# Altium schematic sheet Ethernet.SchDoc: Ethernet PHY with RJ45 connector
size A3; Date: Not used; ApprovedBy: Not used; CheckedBy: Not used; Author: Not used; CompanyName: STMicroelectronics; DrawnBy: Not used; Engineer: Not used; Organization: Not used; Address1: Not used; Address2: Not used; Address3: Not used; Address4: Not used; DocumentNumber: 6; Revision: Not used; SheetNumber: 4; SheetTotal: 10; Time: Not used; ImagePath: Not used; Application_BuildNumber: Not used
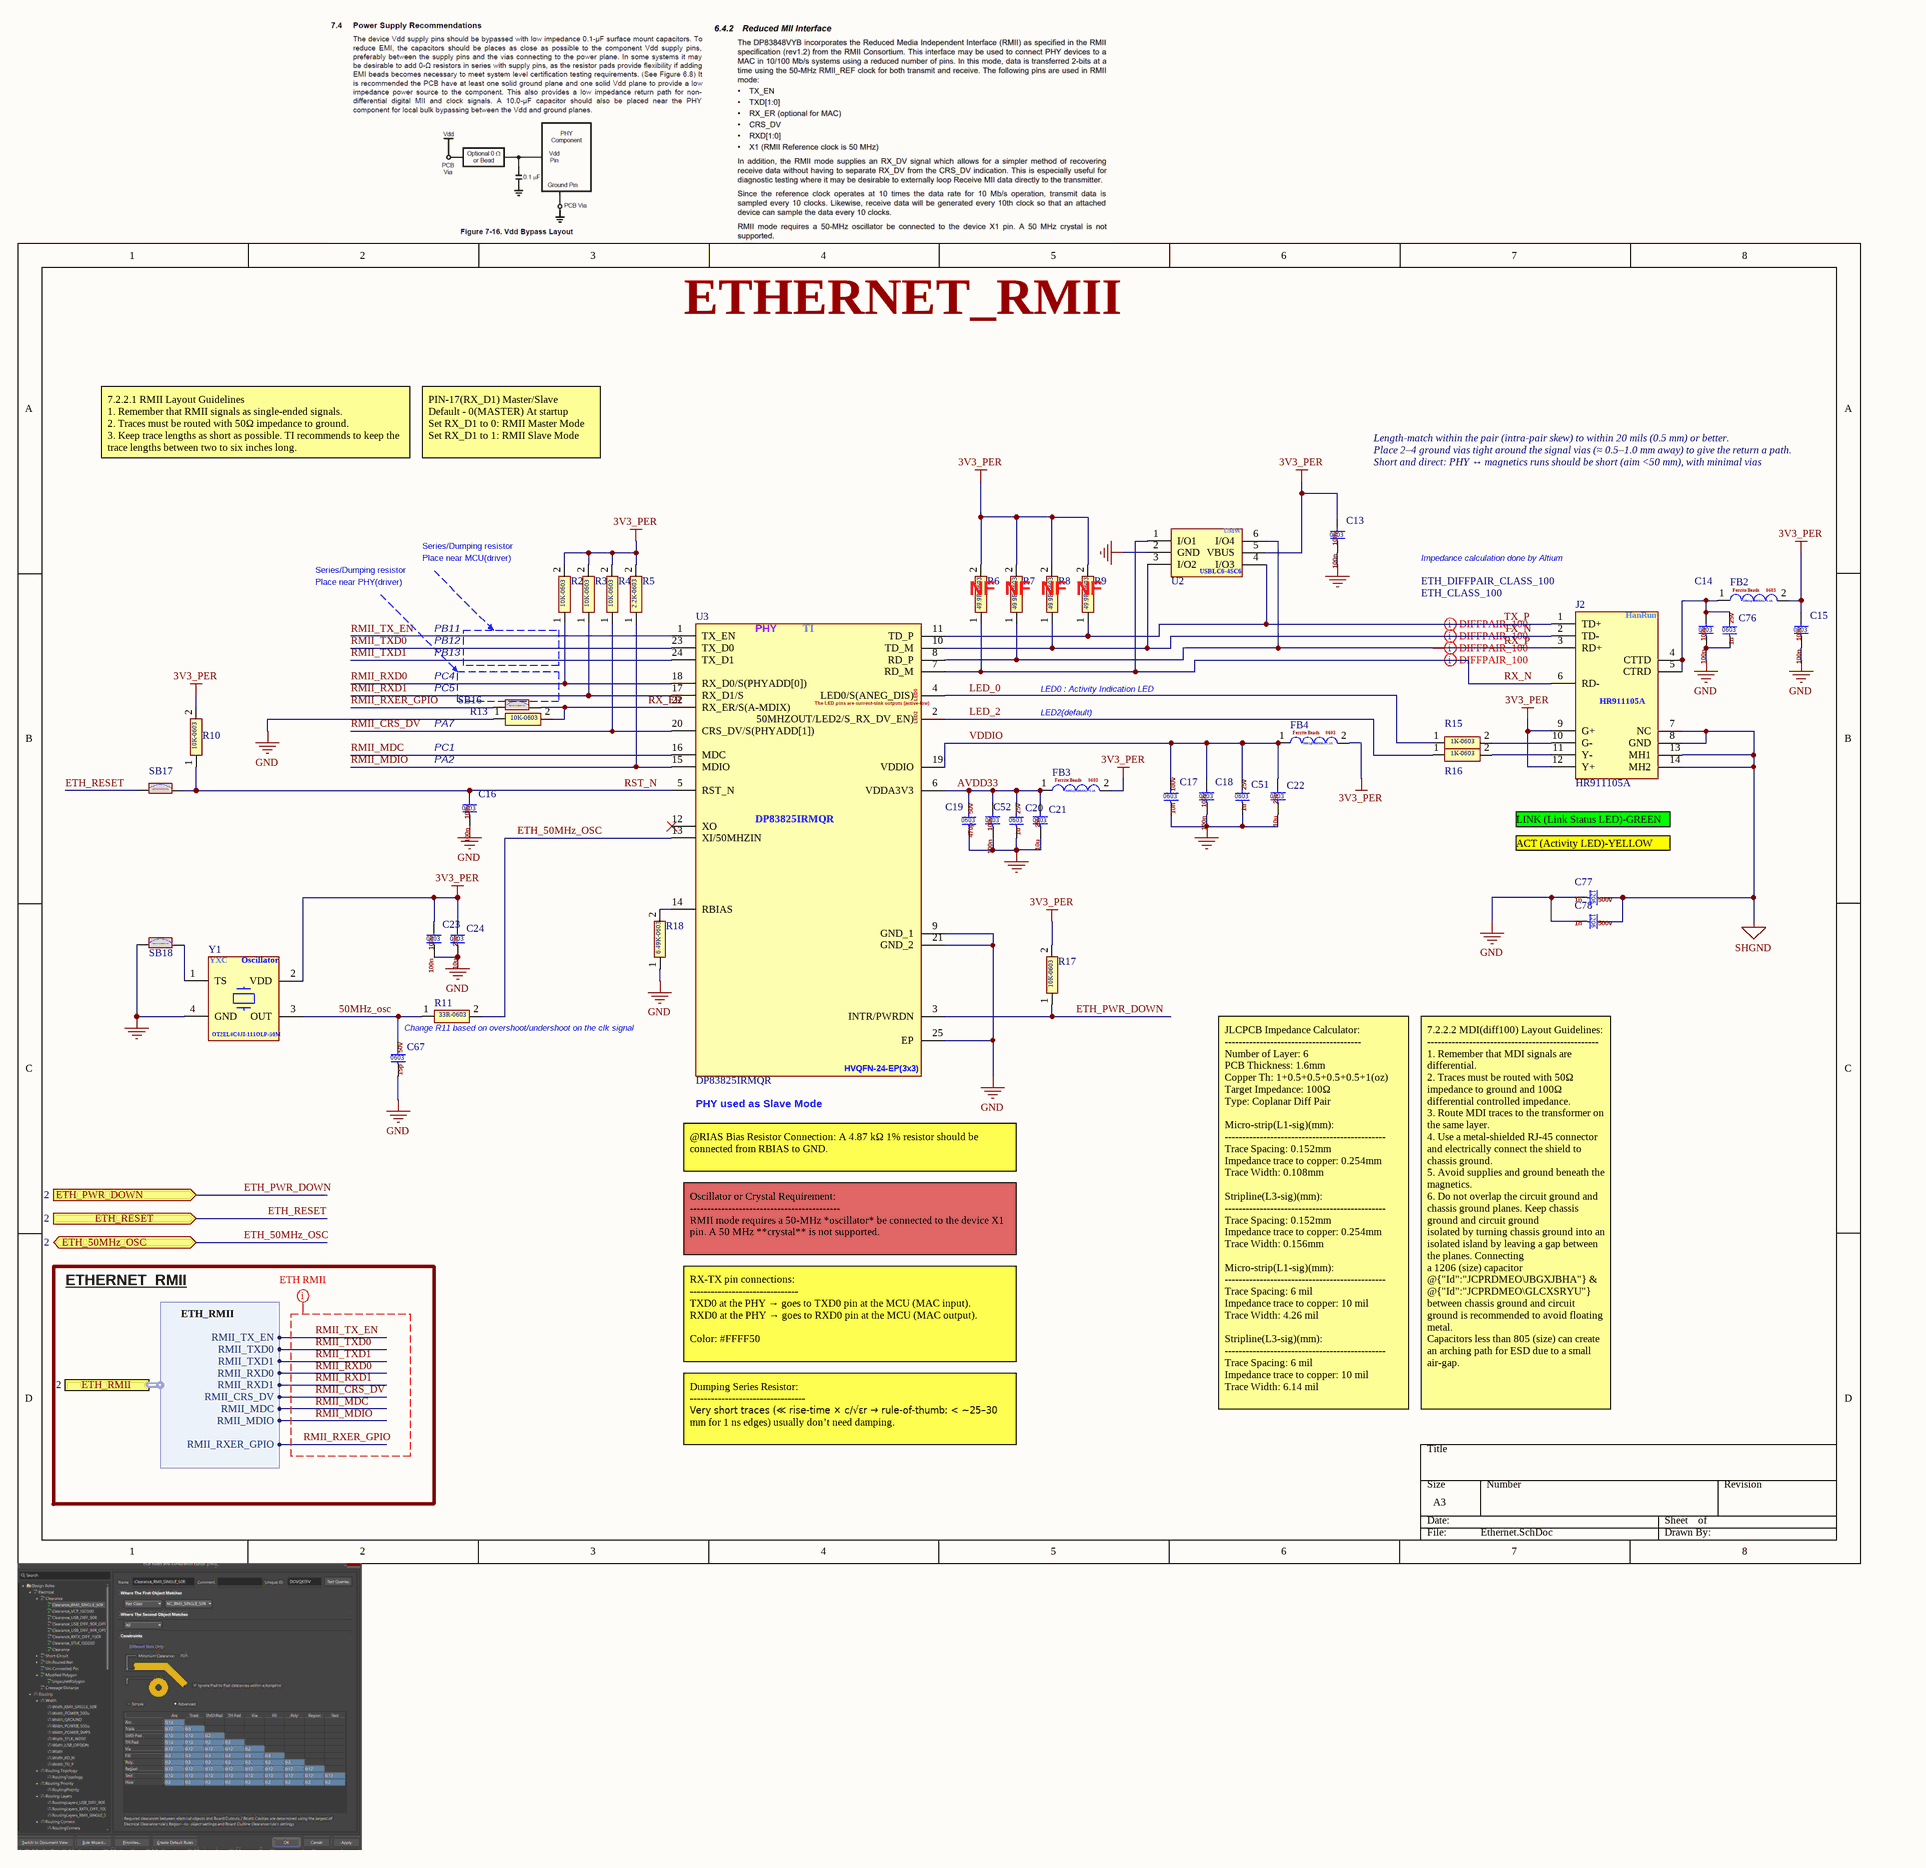
[diagram p0: Ethernet.SchDoc]

## Parts
C13  CL10B104KC8NNNC  [0603-CAP]  (value not drawn)
C14  CL10B104KC8NNNC  [0603-CAP]  (value not drawn)
C15  CL10B104KC8NNNC  [0603-CAP]  (value not drawn)
C16  CL10B104KC8NNNC  [0603-CAP]  (value not drawn)
C17  CL10B103KC8WPNC  [0603-CAP]  (value not drawn)
C18  CL10B104KC8NNNC  [0603-CAP]  (value not drawn)
C19  CL10B471KB8NNNC  [0603-CAP]  (value not drawn)
C20  CL10B105KA8NNNC  [0603-CAP]  (value not drawn)
C21  CL10A106MA8NRNC  [0603-CAP]  (value not drawn)
C22  CL10A106MA8NRNC  [0603-CAP]  (value not drawn)
C23  CL10B104KC8NNNC  [0603-CAP]  (value not drawn)
C24  CL10A106MA8NRNC  [0603-CAP]  (value not drawn)
C51  CL10B105KA8NNNC  [0603-CAP]  (value not drawn)
C52  CL10B104KC8NNNC  [0603-CAP]  (value not drawn)
C67  CL10C150JB8NNNC  [0603-CAP]  (value not drawn)
C76  CL10B105KA8NNNC  [0603-CAP]  (value not drawn)
C77  CL31B102KGFNNNE  [1206-CAP]  (value not drawn)
C78  CL31B102KGFNNNE  [1206-CAP]  (value not drawn)
FB2  BLM18KG601SN1D  [Ferrite Beads 0603]  (value not drawn)
FB3  BLM18KG601SN1D  [Ferrite Beads 0603]  (value not drawn)
FB4  BLM18KG601SN1D  [Ferrite Beads 0603]  (value not drawn)
J2  HR911105A  [HR911105A]
R2  0603WAF1002T5E  [0603-RES]  (value not drawn)
R3  0603WAF1002T5E  [0603-RES]  (value not drawn)
R4  0603WAF1002T5E  [0603-RES]  (value not drawn)
R5  0603WAF2201T5E  [0603-RES]  (value not drawn)
R6  0603WAF499JT5E  [0603-RES]  (value not drawn)
R7  0603WAF499JT5E  [0603-RES]  (value not drawn)
R8  0603WAF499JT5E  [0603-RES]  (value not drawn)
R9  0603WAF499JT5E  [0603-RES]  (value not drawn)
R10  0603WAF1002T5E  [0603-RES]  (value not drawn)
R11  0603WAF330JT5E  [0603-RES]  (value not drawn)
R13  0603WAF1002T5E  [0603-RES]  (value not drawn)
R15  0603WAF1001T5E  [0603-RES]  (value not drawn)
R16  0603WAF1001T5E  [0603-RES]  (value not drawn)
R17  0603WAF1002T5E  [0603-RES]  (value not drawn)
R18  0603WAF6491T5E  [0603-RES]  (value not drawn)
SB16  0603WAF0000T5E  [SOLDER-BRIDGE_R0603-0R]  (value not drawn)
SB17  0603WAF0000T5E  [SOLDER-BRIDGE_R0603-0R]  (value not drawn)
SB18  0603WAF0000T5E  [SOLDER-BRIDGE_R0603-0R]  (value not drawn)
U2  USBLC6-4SC6  [SOT-23-6]  (value not drawn)
U3  DP83825IRMQR  [HVQFN-24-EP(3x3)]
Y1  OT2EL4C4JI-111OLP-50M  [SMD3225-4P]  (value not drawn)

## Ports
ETH_50MHz_OSC (bidir, see 2), ETH_PWR_DOWN (in, see 2), ETH_RESET (in, see 2), ETH_RMII (harness ETH_RMII, see 2)

## Harnesses
ETH_RMII: RMII_TX_EN, RMII_TXD0, RMII_TXD1, RMII_RXD0, RMII_RXD1, RMII_CRS_DV, RMII_RXER_GPIO, RMII_MDC, RMII_MDIO

## Nets
3V3_PER: C13.2 C15.2 C23.2 C24.2 FB2.2 FB3.2 FB4.2 J2.9(G+) J2.12(Y+) R2.2 R3.2 R4.2 R5.2 R6.2 R7.2 R8.2 R9.2 R10.2 R17.2 U2.5(VBUS) Y1.2(VDD)
GND: C13.1 C14.1 C15.1 C16.1 C17.1 C18.1 C19.1 C20.1 C21.1 C22.1 C23.1 C24.1 C51.1 C52.1 C67.1 C76.1 C77.1 C78.1 R13.1 R18.1 SB18.1 U2.2(GND) U3.9(GND_1) U3.21(GND_2) U3.25(EP) Y1.4(GND)
SHGND: C77.2 C78.2 J2.7(NC) J2.8(GND) J2.13(MH1) J2.14(MH2)
50MHz_osc: C67.2 R11.1 Y1.3(OUT)
AVDD33: C19.2 C20.2 C21.2 C52.2 FB3.1 U3.6(VDDA3V3)
ETH_50MHz_OSC: R11.2 U3.13(XI/50MHZIN) ; port ETH_50MHz_OSC
ETH_PWR_DOWN: R17.1 U3.3(INTR/PWRDN) ; port ETH_PWR_DOWN
ETH_RESET: SB17.1 ; port ETH_RESET
LED_0: R15.1 U3.4(LED0/S(ANEG_DIS))
LED_2: R16.1 U3.2(50MHZOUT/LED2/S_RX_DV_EN))
RMII_CRS_DV: R4.1 U3.20(CRS_DV/S(PHYADD[1])) ; port ETH_RMII.RMII_CRS_DV
RMII_MDC: U3.16(MDC) ; port ETH_RMII.RMII_MDC
RMII_MDIO: R5.1 U3.15(MDIO) ; port ETH_RMII.RMII_MDIO
RMII_RXD0: R2.1 U3.18(RX_D0/S(PHYADD[0])) ; port ETH_RMII.RMII_RXD0
RMII_RXD1: R3.1 U3.17(RX_D1/S) ; port ETH_RMII.RMII_RXD1
RMII_RXER_GPIO: SB16.1 ; port ETH_RMII.RMII_RXER_GPIO
RMII_TX_EN: U3.1(TX_EN) ; port ETH_RMII.RMII_TX_EN
RMII_TXD0: U3.23(TX_D0) ; port ETH_RMII.RMII_TXD0
RMII_TXD1: U3.24(TX_D1) ; port ETH_RMII.RMII_TXD1
RST_N: C16.2 R10.1 SB17.2 U3.5(RST_N)
RX_ER: R13.2 SB16.2 U3.22(RX_ER/S(A-MDIX))
RX_N: J2.6(RD-) R6.1 U2.1(I/O1) U3.7(RD_M)
RX_P: J2.3(RD+) R7.1 U2.6(I/O4) U3.8(RD_P)
TX_N: J2.2(TD-) R8.1 U2.3(I/O2) U3.10(TD_M)
TX_P: J2.1(TD+) R9.1 U2.4(I/O3) U3.11(TD_P)
VDDIO: C17.2 C18.2 C22.2 C51.2 FB4.1 U3.19(VDDIO)
NetC14_2: C14.2 C76.2 FB2.1 J2.4(CTTD) J2.5(CTRD)
NetJ2_10: J2.10(G-) R15.2
NetJ2_11: J2.11(Y-) R16.2
NetR18_2: R18.2 U3.14(RBIAS)
NetSB18_2: SB18.2 Y1.1(TS)

Not connected (* = marked no-connect by the designer): U3 12(XO)*

## Layout directives
differential pair; differential pair class ETH_DIFFPAIR_CLASS_100; net class ETH_CLASS_100: RX_N, RX_P, TX_N, TX_P
net class ETH_RMII_CLASS_50; rule Matched Net Lengths [Tolerance = 20mil]: RMII_CRS_DV, RMII_MDC, RMII_MDIO, RMII_RXD0, RMII_RXD1, RMII_RXER_GPIO, RMII_TX_EN, RMII_TXD0, RMII_TXD1

## Notes on the sheet
- ETHERNET_RMII
- 7.2.2.1 RMII Layout Guidelines
  1. Remember that RMII signals as single-ended signals.
  2. Traces must be routed with 50Ω impedance to ground.
  3. Keep trace lengths as short as possible. TI recommends to keep the trace lengths between two to six inches long.
- PIN-17(RX_D1) Master/Slave
  Default - 0(MASTER) At startup
  Set RX_D1 to 0: RMII Master Mode
  Set RX_D1 to 1: RMII Slave Mode
- Length-match within the pair (intra-pair skew) to within 20 mils (0.5 mm) or better.
- Place 2–4 ground vias tight around the signal vias (≈ 0.5–1.0 mm away) to give the return a path.
- Short and direct: PHY ↔ magnetics runs should be short (aim <50 mm), with minimal vias
- Series/Dumping resistor
- Place near MCU(driver)
- Impedance calculation done by Altium
- Place near PHY(driver)
- PB11
- (near R6) NF
- (near R7) NF
- (near R8) NF
- (near R9) NF
- PB12
- PB13
- PC4
- PC5
- LED0 : Activity Indication LED
- PA7
- PC1
- (near U3) Pull-down: Disable Auto-MDIX
- LED2(default)
- (near C16) PA2
- LINK (Link Status LED)-GREEN
- ACT (Activity LED)-YELLOW
- (near R11) Change R11 based on overshoot/undershoot on the clk signal
- PHY used as Slave Mode
- @RIAS Bias Resistor Connection: A 4.87 kΩ 1% resistor should be connected from RBIAS to GND.
- Oscillator or Crystal Requirement:
  -------------------------------------------
  RMII mode requires a 50-MHz *oscillator* be connected to the device X1 pin. A 50 MHz **crystal** is not supported.
- RX-TX pin connections:
  -------------------------------
  TXD0 at the PHY → goes to TXD0 pin at the MCU (MAC input).
  RXD0 at the PHY → goes to RXD0 pin at the MCU (MAC output).
  Color: #FFFF50
- JLCPCB Impedance Calculator:
  ---------------------------------------
  Number of Layer: 6
  PCB Thickness: 1.6mm
  Copper Th: 1+0.5+0.5+0.5+0.5+1(oz)
  Target Impedance: 100Ω
  Type: Coplanar Diff Pair
  Micro-strip(L1-sig)(mm):
  ----------------------------------------------
  Trace Spacing: 0.152mm
  Impedance trace to copper: 0.254mm
  Trace Width: 0.108mm
  Stripline(L3-sig)(mm):
  ----------------------------------------------
  Trace Spacing: 0.152mm
  Impedance trace to copper: 0.254mm
  Trace Width: 0.156mm
  Micro-strip(L1-sig)(mm):
  ----------------------------------------------
  Trace Spacing: 6 mil
  Impedance trace to copper: 10 mil
  Trace Width: 4.26 mil
  Stripline(L3-sig)(mm):
  ----------------------------------------------
  Trace Spacing: 6 mil
  Impedance trace to copper: 10 mil
  Trace Width: 6.14 mil
- 7.2.2.2 MDI(diff100) Layout Guidelines:
  -------------------------------------------------
  1. Remember that MDI signals are differential.
  2. Traces must be routed with 50Ω impedance to ground and 100Ω differential controlled impedance.
  3. Route MDI traces to the transformer on the same layer.
  4. Use a metal-shielded RJ-45 connector and electrically connect the shield to chassis ground.
  5. Avoid supplies and ground beneath the magnetics.
  6. Do not overlap the circuit ground and chassis ground planes. Keep chassis ground and circuit ground
  isolated by turning chassis ground into an isolated island by leaving a gap between the planes. Connecting
  a 1206 (size) capacitor @{"Id":"JCPRDMEO\JBGXJBHA"} & @{"Id":"JCPRDMEO\GLCXSRYU"} between chassis ground and circuit ground is recommended to avoid floating metal.
  Capacitors less than 805 (size) can create an arching path for ESD due to a small air-gap.
- Dumping Series Resistor:
  ---------------------------------
  Very short traces (≪ rise-time × c/√εr → rule-of-thumb: < ~25–30 mm for 1 ns edges) usually don’t need damping.
- Title:
- Project:
- Size:
- Revision:
- Variant:
- A4
- -
- Date:
- Reference:
- Sheet:
- of
- (in symbol 0603WAF330JT5E) 33R-0603
- (in symbol 0603WAF499JT5E) 49.9R-0603
- (in symbol 0603WAF1001T5E) 1K-0603
- (in symbol 0603WAF1002T5E) 10K-0603
- (in symbol 0603WAF2201T5E) 2.2K-0603
- (in symbol 0603WAF6491T5E) 6.49K-0603
- (in symbol BLM18KG601SN1D) Ferrite Beads; 0603; 600Ω@100MHz, 1.3A
- (in symbol CL10A106MA8NRNC) 25v; 0603; 10u
- (in symbol CL10B103KC8WPNC) 100v; 0603; 10n
- (in symbol CL10B104KC8NNNC) 100v; 0603; 100n
- (in symbol CL10B105KA8NNNC) 25v; 0603; 1u
- (in symbol CL10B471KB8NNNC) 50v; 0603; 470p
- (in symbol CL10C150JB8NNNC) 50v; 0603; 15p
- (in symbol CL31B102KGFNNNE) 1206; 1n; 500v
- (in symbol DP83825IRMQR) PHY; TI; LED0; The LED pins are current-sink outputs (active-low); LED2; HVQFN-24-EP(3x3)
- (in symbol HR911105A) HanRun
- (in symbol OT2EL4C4JI-111OLP-50M) YXC; Oscillator
- (in symbol USBLC6-4SC6) UMW

## Library data of the parts
C13-C16 C18 C23 C52 = CL10B104KC8NNNC: CAP: CER 100NF 100V X7R 0603; POC Price: 0.006; LCSC Part #: C15725; Unit Price: 0.0036; ComponentLink1Description: DS; ComponentLink1URL: https://www.lcsc.com/datasheet/C15725.pdf
C17 = CL10B103KC8WPNC: CAP: CER 10NF 100V X7R 0603; LCSC Part #: C307347; Unit Price: 0.0046
C19 = CL10B471KB8NNNC: CAP: CER 470PF 50V X7R 0603; POC Price: 0.0047; LCSC Part #: C22396; Unit Price: 0.002; ComponentLink1Description: DS; ComponentLink1URL: https://www.lcsc.com/datasheet/C22396.pdf
C20 C51 C76 = CL10B105KA8NNNC: CAP: CER 1UF 25V X7R 0603; LCSC Part #: C29936; Unit Price: 0.0027; ComponentLink1Description: DS; ComponentLink1URL: https://www.lcsc.com/datasheet/C29936.pdf
C21 C22 C24 = CL10A106MA8NRNC: CAP: CER 10UF 25V X5R 0603; LCSC Part #: C96446; Unit Price: 0.01; ComponentLink1Description: DS; ComponentLink1URL: https://www.lcsc.com/datasheet/C96446.pdf
C67 = CL10C150JB8NNNC: CAP: CER 15PF 50V C0G 0603; POC Price: 0.0051; LCSC Part #: C1644; Unit Price: 0.0032; ComponentLink1Description: DS; ComponentLink1URL: https://www.lcsc.com/datasheet/C1644.pdf
C77 C78 = CL31B102KGFNNNE: CAP: SAFETY CER 1NF 500V X7R 1206; POC Price: 0.04; LCSC Part #: C35216; Unit Price: 0.0223; ComponentLink1Description: DS; ComponentLink1URL: https://www.lcsc.com/datasheet/C35216.pdf
FB2-FB4 = BLM18KG601SN1D: Ferrite Beads: 150mΩ 600Ω@100MHz 1.3A muRata; POC Price: 0.0113; LCSC Part #: C85833; Unit Price: 0.0059; ComponentLink1Description: DS; ComponentLink1URL: https://www.lcsc.com/datasheet/C85833.pdf
J2 = HR911105A: RJ45: ETH RJ45 Jack 1 With LED Through Hole Ethernet Connectors / Modular Connectors (RJ45 RJ11) ROHS; POC Price: 1.4848; LCSC Part #: C12074; Unit Price: 0.8599; ComponentLink1Description: DS; ComponentLink1URL: https://datasheet.lcsc.com/szlcsc/Zhongshan-HanRun-Elec-HR911105A_C12074.pdf
R2-R4 R10 R13 R17 = 0603WAF1002T5E: RES: 10K OHM 1% 100mW 0603 75V; LCSC Part #: C25804; Unit Price: 0.0005; ComponentLink1Description: DS; ComponentLink1URL: https://www.lcsc.com/datasheet/C25804.pdf
R5 = 0603WAF2201T5E: RES: 2.2K OHM 1% 100mW 0603 75V; POC Price: 0.0011; LCSC Part #: C4190; Unit Price: 0.0005; ComponentLink1Description: DS; ComponentLink1URL: https://www.lcsc.com/datasheet/C4184.pdf
R6-R9 = 0603WAF499JT5E: RES: 49.9 OHM 1% 100mW 0603; LCSC Part #: C23185; Unit Price: 0.0006; ComponentLink1Description: DS; ComponentLink1URL: https://www.lcsc.com/datasheet/C23185.pdf
R11 = 0603WAF330JT5E: RES: 33 OHM 1% 100mW 0603 75V; POC Price: 0.0011; LCSC Part #: C23140; Unit Price: 0.0006; ComponentLink1Description: DS; ComponentLink1URL: https://www.lcsc.com/datasheet/C4216.pdf
R15 R16 = 0603WAF1001T5E: RES: 1K OHM 1% 100mW 0603 75V; LCSC Part #: C21190; Unit Price: 0.0005; ComponentLink1Description: DS; ComponentLink1URL: https://www.lcsc.com/datasheet/C21190.pdf
R18 = 0603WAF6491T5E: RES: 6.49K OHM 1% 100mW 0603 75V; POC Price: 0.0011; LCSC Part #: C23088; Unit Price: 0.0006; ComponentLink1Description: DS; ComponentLink1URL: https://www.lcsc.com/datasheet/C23088.pdf
SB16-SB18 = 0603WAF0000T5E: Solder Bridge: ON SB 0603; LCSC Part #: C21189; Unit Price: 0.0006; ComponentLink1Description: DS; ComponentLink1URL: https://www.lcsc.com/datasheet/C21189.pdf
U2 = USBLC6-4SC6: ESD: 3.5A@8/20us 13V 60W@8/20us 7.8V 5V SOT-23-6 ESD and Surge Protection (TVS/ESD) ROHS; POC Price: 0.0286; LCSC Part #: C19626383; Unit Price: 0.0133; ComponentLink1Description: DS; ComponentLink1URL: https://www.lcsc.com/datasheet/C19626383.pdf
U3 = DP83825IRMQR: PHY: Ethernet Transceiver RMII HVQFN-24-EP(3x3) Ethernet Transceivers ROHS; POC Price: 0.2675; LCSC Part #: C783599; ComponentLink1Description: DS; ComponentLink1URL: https://www.ti.com/lit/ds/symlink/dp83825i.pdf?ts=1756962275334&ref_url=https%253A%252F%252Fwww.ti.com%252Fproduct%252FDP83825I%252Fpart-details%252FDP83825IRMQR; Unit Price: 0.1317
Y1 = OT2EL4C4JI-111OLP-50M: Crystal: 1.8V~3.3V ±10ppm ±20ppm CMOS 50MHz SMD3225-4P Crystal Oscillators ROHS; POC Price: 0.4204; LCSC Part #: C5203552; Unit Price: 0.2026; ComponentLink2Description: DS; ComponentLink2URL: https://www.lcsc.com/datasheet/C5203552.pdf